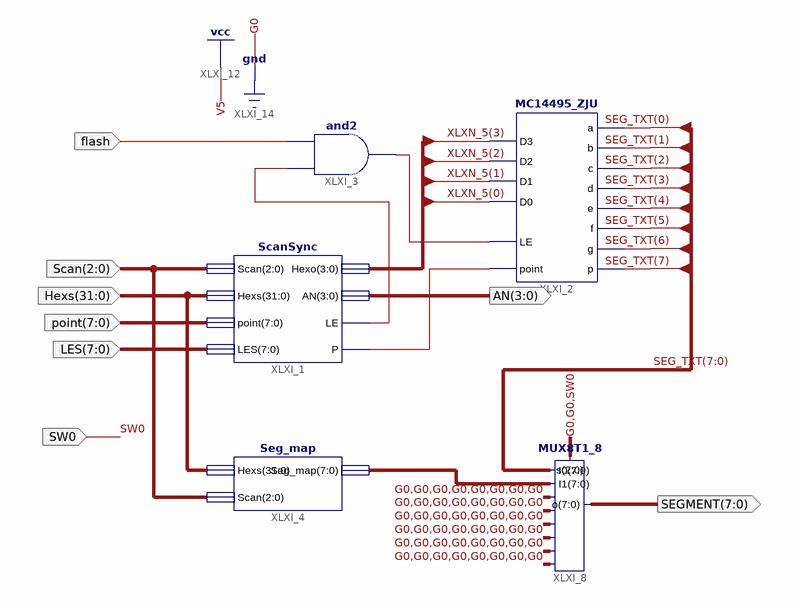
[diagram p0: schematic sheet 1]
// Xilinx ISE schematic Seg7_Dev.sch (kintex7) as structural Verilog: 5 symbols, 8 ports
module Seg7_Dev (
  input  [2:0] Scan,
  input  [31:0] Hexs,
  input  [7:0] point,
  input  [7:0] LES,
  input  flash,
  input  SW0,
  output [3:0] AN,
  output [7:0] SEGMENT
);

  wire XLXN_6, XLXN_7, XLXN_8;
  wire [3:0] XLXN_5;
  wire [7:0] SEG_TXT, XLXN_25;

  ScanSync XLXI_1 (.Scan(Scan), .Hexs(Hexs), .point(point), .LES(LES), .Hexo(XLXN_5), .AN(AN), .LE(XLXN_7), .P(XLXN_6));
  MC14495_ZJU XLXI_2 (
    .D0(XLXN_5[0]), .D1(XLXN_5[1]), .D2(XLXN_5[2]), .D3(XLXN_5[3]), .p(SEG_TXT[7]), .g(SEG_TXT[6]),
    .f(SEG_TXT[5]), .e(SEG_TXT[4]), .d(SEG_TXT[3]), .c(SEG_TXT[2]), .b(SEG_TXT[1]), .a(SEG_TXT[0]),
    .point(XLXN_6), .LE(XLXN_8));
  and XLXI_3 (XLXN_8, XLXN_7, flash);
  Seg_map XLXI_4 (.Hexs(Hexs), .Scan(Scan), .Seg_map(XLXN_25));
  MUX8T1_8 XLXI_8 (
    .s({2'b00, SW0}), .I7({8{1'b0}}), .I6({8{1'b0}}), .I5({8{1'b0}}), .I4({8{1'b0}}), .I3({8{1'b0}}),
    .I2({8{1'b0}}), .I1(XLXN_25), .I0(SEG_TXT), .o(SEGMENT));
endmodule
